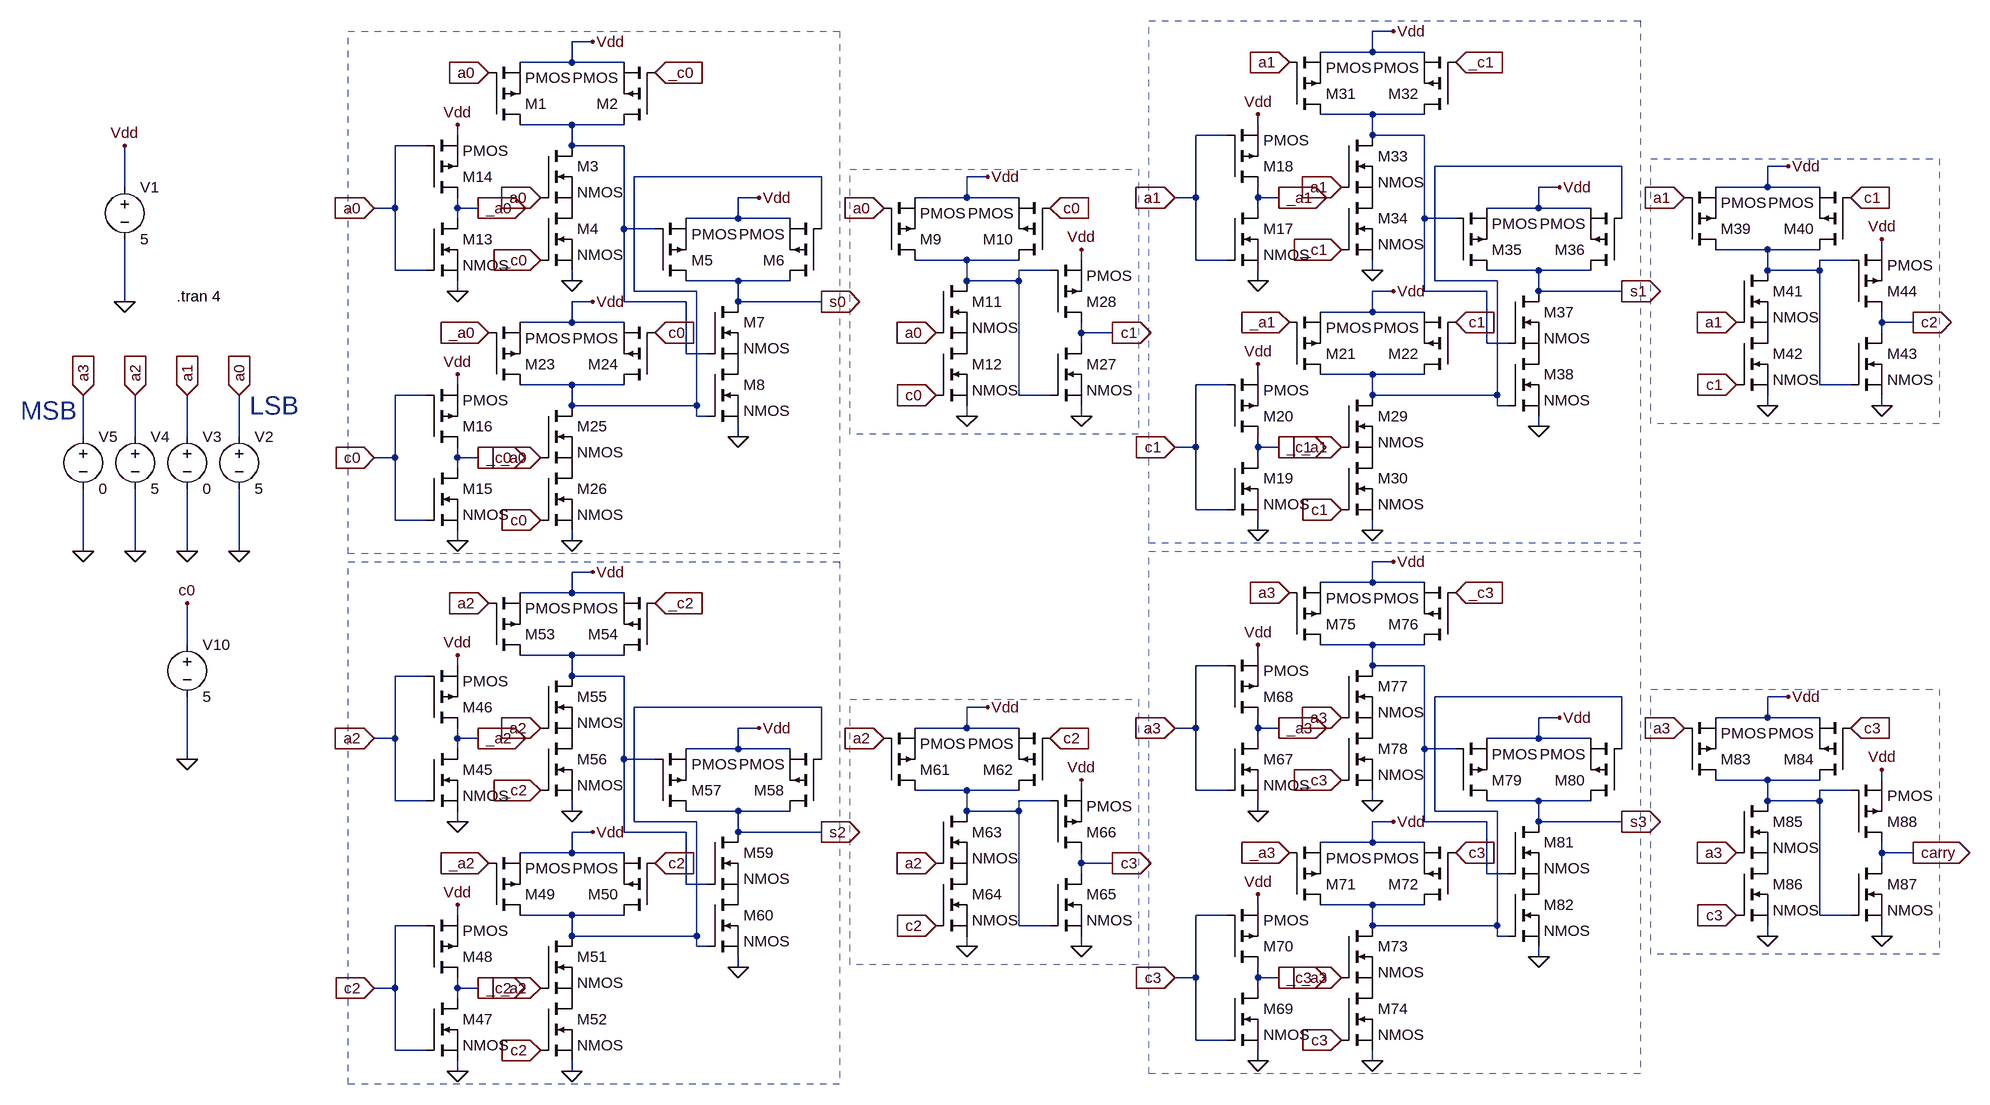
[diagram p0: schematic 4 bit 1 Increment.asc]
4 bit 1 Increment.asc, the LTspice schematic file:
Version 4
SHEET 1 2684 1276
WIRE 1568 -736 1536 -736
WIRE 336 -720 304 -720
WIRE 1536 -704 1536 -736
WIRE 1536 -704 1456 -704
WIRE 1616 -704 1536 -704
WIRE 304 -688 304 -720
WIRE 304 -688 224 -688
WIRE 384 -688 304 -688
WIRE 1536 -608 1456 -608
WIRE 1616 -608 1536 -608
WIRE 304 -592 224 -592
WIRE 384 -592 304 -592
WIRE 1360 -592 1360 -608
WIRE 128 -576 128 -592
WIRE 1312 -576 1264 -576
WIRE 1536 -576 1536 -608
WIRE 1616 -576 1536 -576
WIRE 80 -560 32 -560
WIRE 304 -560 304 -592
WIRE 384 -560 304 -560
WIRE 1920 -528 1632 -528
WIRE 2176 -528 2144 -528
WIRE 688 -512 400 -512
WIRE 944 -512 912 -512
WIRE -384 -496 -384 -560
WIRE 1824 -496 1792 -496
WIRE 2144 -496 2144 -528
WIRE 2144 -496 2064 -496
WIRE 2224 -496 2144 -496
WIRE 592 -480 560 -480
WIRE 912 -480 912 -512
WIRE 912 -480 832 -480
WIRE 992 -480 912 -480
WIRE 1264 -480 1264 -576
WIRE 1264 -480 1232 -480
WIRE 1360 -480 1360 -496
WIRE 1392 -480 1360 -480
WIRE 32 -464 32 -560
WIRE 32 -464 0 -464
WIRE 128 -464 128 -480
WIRE 160 -464 128 -464
WIRE 1360 -464 1360 -480
WIRE 1792 -464 1792 -496
WIRE 1792 -464 1712 -464
WIRE 1872 -464 1792 -464
WIRE 128 -448 128 -464
WIRE 560 -448 560 -480
WIRE 560 -448 480 -448
WIRE 640 -448 560 -448
WIRE 1616 -448 1616 -576
WIRE 1664 -448 1616 -448
WIRE 1920 -448 1920 -528
WIRE 384 -432 384 -560
WIRE 432 -432 384 -432
WIRE 688 -432 688 -512
WIRE 2144 -400 2064 -400
WIRE 2224 -400 2144 -400
WIRE 2320 -400 2320 -416
WIRE 912 -384 832 -384
WIRE 992 -384 912 -384
WIRE 1088 -384 1088 -400
WIRE 1264 -384 1264 -480
WIRE 1312 -384 1264 -384
WIRE 2272 -384 2224 -384
WIRE 32 -368 32 -464
WIRE 80 -368 32 -368
WIRE 1040 -368 992 -368
WIRE 1536 -368 1536 -384
WIRE 1792 -368 1712 -368
WIRE 1872 -368 1792 -368
WIRE 2144 -368 2144 -400
WIRE 2224 -368 2224 -384
WIRE 2224 -368 2144 -368
WIRE 304 -352 304 -368
WIRE 560 -352 480 -352
WIRE 640 -352 560 -352
WIRE 912 -352 912 -384
WIRE 992 -352 992 -368
WIRE 992 -352 912 -352
WIRE 1360 -352 1360 -368
WIRE 1632 -352 1632 -528
WIRE 1728 -352 1632 -352
WIRE 128 -336 128 -352
WIRE 400 -336 400 -512
WIRE 496 -336 400 -336
WIRE 1568 -336 1536 -336
WIRE 1616 -336 1616 -448
WIRE 1712 -336 1616 -336
WIRE 1792 -336 1792 -368
WIRE 1920 -336 1792 -336
WIRE -384 -320 -384 -416
WIRE 336 -320 304 -320
WIRE 384 -320 384 -432
WIRE 480 -320 384 -320
WIRE 560 -320 560 -352
WIRE 688 -320 560 -320
WIRE 1536 -304 1536 -336
WIRE 1536 -304 1456 -304
WIRE 1616 -304 1536 -304
WIRE 304 -288 304 -320
WIRE 304 -288 224 -288
WIRE 384 -288 304 -288
WIRE 2320 -288 2320 -304
WIRE 2368 -288 2320 -288
WIRE 1088 -272 1088 -288
WIRE 1136 -272 1088 -272
WIRE 2320 -272 2320 -288
WIRE 1088 -256 1088 -272
WIRE 1712 -256 1712 -336
WIRE 1744 -256 1712 -256
WIRE 480 -240 480 -320
WIRE 512 -240 480 -240
WIRE 1360 -208 1360 -224
WIRE 1536 -208 1456 -208
WIRE 1616 -208 1536 -208
WIRE 128 -192 128 -208
WIRE 304 -192 224 -192
WIRE 384 -192 304 -192
WIRE 1312 -192 1264 -192
WIRE 2224 -192 2224 -368
WIRE 2272 -192 2224 -192
WIRE 80 -176 32 -176
WIRE 992 -176 992 -352
WIRE 1040 -176 992 -176
WIRE 1536 -176 1536 -208
WIRE 1728 -176 1728 -352
WIRE 1728 -176 1536 -176
WIRE 304 -160 304 -192
WIRE 496 -160 496 -336
WIRE 496 -160 304 -160
WIRE 1728 -160 1728 -176
WIRE 1744 -160 1728 -160
WIRE 2144 -160 2144 -176
WIRE 2320 -160 2320 -176
WIRE 496 -144 496 -160
WIRE 512 -144 496 -144
WIRE 912 -144 912 -160
WIRE 1088 -144 1088 -160
WIRE 1792 -128 1792 -144
WIRE -448 -112 -448 -176
WIRE -368 -112 -368 -176
WIRE -288 -112 -288 -176
WIRE -208 -112 -208 -176
WIRE 560 -112 560 -128
WIRE 1264 -96 1264 -192
WIRE 1264 -96 1232 -96
WIRE 1360 -96 1360 -112
WIRE 1392 -96 1360 -96
WIRE 32 -80 32 -176
WIRE 32 -80 0 -80
WIRE 128 -80 128 -96
WIRE 160 -80 128 -80
WIRE 1360 -80 1360 -96
WIRE 128 -64 128 -80
WIRE 1264 0 1264 -96
WIRE 1312 0 1264 0
WIRE 32 16 32 -80
WIRE 80 16 32 16
WIRE 1360 32 1360 16
WIRE 1536 32 1536 16
WIRE 128 48 128 32
WIRE 304 48 304 32
WIRE -448 64 -448 -32
WIRE -368 64 -368 -32
WIRE -288 64 -288 -32
WIRE -208 64 -208 -32
WIRE 1568 80 1536 80
WIRE 336 96 304 96
WIRE 1536 112 1536 80
WIRE 1536 112 1456 112
WIRE 1616 112 1536 112
WIRE 304 128 304 96
WIRE 304 128 224 128
WIRE 384 128 304 128
WIRE -288 208 -288 144
WIRE 1536 208 1456 208
WIRE 1616 208 1536 208
WIRE 304 224 224 224
WIRE 384 224 304 224
WIRE 1360 224 1360 208
WIRE 128 240 128 224
WIRE 1312 240 1264 240
WIRE 1536 240 1536 208
WIRE 1616 240 1536 240
WIRE 80 256 32 256
WIRE 304 256 304 224
WIRE 384 256 304 256
WIRE 1920 288 1632 288
WIRE 2176 288 2144 288
WIRE 688 304 400 304
WIRE 944 304 912 304
WIRE 1824 320 1792 320
WIRE 2144 320 2144 288
WIRE 2144 320 2064 320
WIRE 2224 320 2144 320
WIRE 592 336 560 336
WIRE 912 336 912 304
WIRE 912 336 832 336
WIRE 992 336 912 336
WIRE 1264 336 1264 240
WIRE 1264 336 1232 336
WIRE 1360 336 1360 320
WIRE 1392 336 1360 336
WIRE 32 352 32 256
WIRE 32 352 0 352
WIRE 128 352 128 336
WIRE 160 352 128 352
WIRE 1360 352 1360 336
WIRE 1792 352 1792 320
WIRE 1792 352 1712 352
WIRE 1872 352 1792 352
WIRE 128 368 128 352
WIRE 560 368 560 336
WIRE 560 368 480 368
WIRE 640 368 560 368
WIRE 1616 368 1616 240
WIRE 1664 368 1616 368
WIRE 1920 368 1920 288
WIRE -288 384 -288 288
WIRE 384 384 384 256
WIRE 432 384 384 384
WIRE 688 384 688 304
WIRE 2144 416 2064 416
WIRE 2224 416 2144 416
WIRE 2320 416 2320 400
WIRE 912 432 832 432
WIRE 992 432 912 432
WIRE 1088 432 1088 416
WIRE 1264 432 1264 336
WIRE 1312 432 1264 432
WIRE 2272 432 2224 432
WIRE 32 448 32 352
WIRE 80 448 32 448
WIRE 1040 448 992 448
WIRE 1536 448 1536 432
WIRE 1792 448 1712 448
WIRE 1872 448 1792 448
WIRE 2144 448 2144 416
WIRE 2224 448 2224 432
WIRE 2224 448 2144 448
WIRE 304 464 304 448
WIRE 560 464 480 464
WIRE 640 464 560 464
WIRE 912 464 912 432
WIRE 992 464 992 448
WIRE 992 464 912 464
WIRE 1360 464 1360 448
WIRE 1632 464 1632 288
WIRE 1728 464 1632 464
WIRE 128 480 128 464
WIRE 400 480 400 304
WIRE 496 480 400 480
WIRE 1568 480 1536 480
WIRE 1616 480 1616 368
WIRE 1712 480 1616 480
WIRE 1792 480 1792 448
WIRE 1920 480 1792 480
WIRE 336 496 304 496
WIRE 384 496 384 384
WIRE 480 496 384 496
WIRE 560 496 560 464
WIRE 688 496 560 496
WIRE 1536 512 1536 480
WIRE 1536 512 1456 512
WIRE 1616 512 1536 512
WIRE 304 528 304 496
WIRE 304 528 224 528
WIRE 384 528 304 528
WIRE 2320 528 2320 512
WIRE 2368 528 2320 528
WIRE 1088 544 1088 528
WIRE 1136 544 1088 544
WIRE 2320 544 2320 528
WIRE 1088 560 1088 544
WIRE 1712 560 1712 480
WIRE 1744 560 1712 560
WIRE 480 576 480 496
WIRE 512 576 480 576
WIRE 1360 608 1360 592
WIRE 1536 608 1456 608
WIRE 1616 608 1536 608
WIRE 128 624 128 608
WIRE 304 624 224 624
WIRE 384 624 304 624
WIRE 1312 624 1264 624
WIRE 2224 624 2224 448
WIRE 2272 624 2224 624
WIRE 80 640 32 640
WIRE 992 640 992 464
WIRE 1040 640 992 640
WIRE 1536 640 1536 608
WIRE 1728 640 1728 464
WIRE 1728 640 1536 640
WIRE 304 656 304 624
WIRE 496 656 496 480
WIRE 496 656 304 656
WIRE 1728 656 1728 640
WIRE 1744 656 1728 656
WIRE 2144 656 2144 640
WIRE 2320 656 2320 640
WIRE 496 672 496 656
WIRE 512 672 496 672
WIRE 912 672 912 656
WIRE 1088 672 1088 656
WIRE 1792 688 1792 672
WIRE 560 704 560 688
WIRE 1264 720 1264 624
WIRE 1264 720 1232 720
WIRE 1360 720 1360 704
WIRE 1392 720 1360 720
WIRE 32 736 32 640
WIRE 32 736 0 736
WIRE 128 736 128 720
WIRE 160 736 128 736
WIRE 1360 736 1360 720
WIRE 128 752 128 736
WIRE 1264 816 1264 720
WIRE 1312 816 1264 816
WIRE 32 832 32 736
WIRE 80 832 32 832
WIRE 1360 848 1360 832
WIRE 1536 848 1536 832
WIRE 128 864 128 848
WIRE 304 864 304 848
FLAG 128 -336 0
FLAG 128 -592 Vdd
FLAG 160 -464 _a0
IOPIN 160 -464 Out
FLAG 0 -464 a0
IOPIN 0 -464 In
FLAG 128 48 0
FLAG 128 -208 Vdd
FLAG 160 -80 _c0
IOPIN 160 -80 Out
FLAG 0 -80 c0
IOPIN 0 -80 In
FLAG 336 -320 Vdd
FLAG 304 48 0
FLAG 256 -80 _a0
IOPIN 256 -80 In
FLAG 432 -272 c0
IOPIN 432 -272 In
FLAG 256 16 c0
IOPIN 256 16 In
FLAG 176 -272 _a0
IOPIN 176 -272 In
FLAG 336 -720 Vdd
FLAG 304 -352 0
FLAG 256 -480 a0
IOPIN 256 -480 In
FLAG 432 -672 _c0
IOPIN 432 -672 In
FLAG 256 -384 _c0
IOPIN 256 -384 In
FLAG 176 -672 a0
IOPIN 176 -672 In
FLAG 592 -480 Vdd
FLAG 560 -112 0
FLAG 688 -320 s0
IOPIN 688 -320 Out
FLAG 944 -512 Vdd
FLAG 912 -144 0
FLAG 864 -272 a0
IOPIN 864 -272 In
FLAG 1040 -464 c0
IOPIN 1040 -464 In
FLAG 784 -464 a0
IOPIN 784 -464 In
FLAG 864 -176 c0
IOPIN 864 -176 In
FLAG 1088 -144 0
FLAG 1088 -400 Vdd
FLAG 1136 -272 c1
IOPIN 1136 -272 Out
FLAG -384 -320 0
FLAG -384 -560 Vdd
FLAG -208 64 0
FLAG -208 -176 a0
IOPIN -208 -176 In
FLAG -288 64 0
FLAG -288 -176 a1
IOPIN -288 -176 In
FLAG -368 64 0
FLAG -368 -176 a2
IOPIN -368 -176 In
FLAG -448 64 0
FLAG -448 -176 a3
IOPIN -448 -176 In
FLAG 1360 -352 0
FLAG 1360 -608 Vdd
FLAG 1392 -480 _a1
IOPIN 1392 -480 Out
FLAG 1232 -480 a1
IOPIN 1232 -480 In
FLAG 1360 32 0
FLAG 1360 -224 Vdd
FLAG 1392 -96 _c1
IOPIN 1392 -96 Out
FLAG 1232 -96 c1
IOPIN 1232 -96 In
FLAG 1568 -336 Vdd
FLAG 1536 32 0
FLAG 1488 -96 _a1
IOPIN 1488 -96 In
FLAG 1664 -288 c1
IOPIN 1664 -288 In
FLAG 1488 0 c1
IOPIN 1488 0 In
FLAG 1408 -288 _a1
IOPIN 1408 -288 In
FLAG 1568 -736 Vdd
FLAG 1536 -368 0
FLAG 1488 -496 a1
IOPIN 1488 -496 In
FLAG 1664 -688 _c1
IOPIN 1664 -688 In
FLAG 1488 -400 _c1
IOPIN 1488 -400 In
FLAG 1408 -688 a1
IOPIN 1408 -688 In
FLAG 1824 -496 Vdd
FLAG 1792 -128 0
FLAG 1920 -336 s1
IOPIN 1920 -336 Out
FLAG 2176 -528 Vdd
FLAG 2144 -160 0
FLAG 2096 -288 a1
IOPIN 2096 -288 In
FLAG 2272 -480 c1
IOPIN 2272 -480 In
FLAG 2016 -480 a1
IOPIN 2016 -480 In
FLAG 2096 -192 c1
IOPIN 2096 -192 In
FLAG 2320 -160 0
FLAG 2320 -416 Vdd
FLAG 2368 -288 c2
IOPIN 2368 -288 Out
FLAG 128 480 0
FLAG 128 224 Vdd
FLAG 160 352 _a2
IOPIN 160 352 Out
FLAG 0 352 a2
IOPIN 0 352 In
FLAG 128 864 0
FLAG 128 608 Vdd
FLAG 160 736 _c2
IOPIN 160 736 Out
FLAG 0 736 c2
IOPIN 0 736 In
FLAG 336 496 Vdd
FLAG 304 864 0
FLAG 256 736 _a2
IOPIN 256 736 In
FLAG 432 544 c2
IOPIN 432 544 In
FLAG 256 832 c2
IOPIN 256 832 In
FLAG 176 544 _a2
IOPIN 176 544 In
FLAG 336 96 Vdd
FLAG 304 464 0
FLAG 256 336 a2
IOPIN 256 336 In
FLAG 432 144 _c2
IOPIN 432 144 In
FLAG 256 432 _c2
IOPIN 256 432 In
FLAG 176 144 a2
IOPIN 176 144 In
FLAG 592 336 Vdd
FLAG 560 704 0
FLAG 688 496 s2
IOPIN 688 496 Out
FLAG 944 304 Vdd
FLAG 912 672 0
FLAG 864 544 a2
IOPIN 864 544 In
FLAG 1040 352 c2
IOPIN 1040 352 In
FLAG 784 352 a2
IOPIN 784 352 In
FLAG 864 640 c2
IOPIN 864 640 In
FLAG 1088 672 0
FLAG 1088 416 Vdd
FLAG 1136 544 c3
IOPIN 1136 544 Out
FLAG 1360 464 0
FLAG 1360 208 Vdd
FLAG 1392 336 _a3
IOPIN 1392 336 Out
FLAG 1232 336 a3
IOPIN 1232 336 In
FLAG 1360 848 0
FLAG 1360 592 Vdd
FLAG 1392 720 _c3
IOPIN 1392 720 Out
FLAG 1232 720 c3
IOPIN 1232 720 In
FLAG 1568 480 Vdd
FLAG 1536 848 0
FLAG 1488 720 _a3
IOPIN 1488 720 In
FLAG 1664 528 c3
IOPIN 1664 528 In
FLAG 1488 816 c3
IOPIN 1488 816 In
FLAG 1408 528 _a3
IOPIN 1408 528 In
FLAG 1568 80 Vdd
FLAG 1536 448 0
FLAG 1488 320 a3
IOPIN 1488 320 In
FLAG 1664 128 _c3
IOPIN 1664 128 In
FLAG 1488 416 _c3
IOPIN 1488 416 In
FLAG 1408 128 a3
IOPIN 1408 128 In
FLAG 1824 320 Vdd
FLAG 1792 688 0
FLAG 1920 480 s3
IOPIN 1920 480 Out
FLAG 2176 288 Vdd
FLAG 2144 656 0
FLAG 2096 528 a3
IOPIN 2096 528 In
FLAG 2272 336 c3
IOPIN 2272 336 In
FLAG 2016 336 a3
IOPIN 2016 336 In
FLAG 2096 624 c3
IOPIN 2096 624 In
FLAG 2320 656 0
FLAG 2320 400 Vdd
FLAG 2368 528 carry
IOPIN 2368 528 Out
FLAG -288 384 0
FLAG -288 144 c0
SYMBOL nmos 80 -448 R0
SYMATTR InstName M13
SYMBOL pmos 80 -480 M180
SYMATTR InstName M14
SYMBOL nmos 80 -64 R0
SYMATTR InstName M15
SYMBOL pmos 80 -96 M180
SYMATTR InstName M16
SYMBOL pmos 176 -192 M180
SYMATTR InstName M23
SYMBOL pmos 432 -192 R180
SYMATTR InstName M24
SYMBOL nmos 256 -160 R0
SYMATTR InstName M25
SYMBOL nmos 256 -64 R0
SYMATTR InstName M26
SYMBOL pmos 176 -592 M180
SYMATTR InstName M1
SYMBOL pmos 432 -592 R180
SYMATTR InstName M2
SYMBOL nmos 256 -560 R0
SYMATTR InstName M3
SYMBOL nmos 256 -464 R0
SYMATTR InstName M4
SYMBOL pmos 432 -352 M180
SYMATTR InstName M5
SYMBOL pmos 688 -352 R180
SYMATTR InstName M6
SYMBOL nmos 512 -320 R0
SYMATTR InstName M7
SYMBOL nmos 512 -224 R0
SYMATTR InstName M8
SYMBOL pmos 784 -384 M180
SYMATTR InstName M9
SYMBOL pmos 1040 -384 R180
SYMATTR InstName M10
SYMBOL nmos 864 -352 R0
SYMATTR InstName M11
SYMBOL nmos 864 -256 R0
SYMATTR InstName M12
SYMBOL nmos 1040 -256 R0
SYMATTR InstName M27
SYMBOL pmos 1040 -288 M180
SYMATTR InstName M28
SYMBOL voltage -384 -512 R0
SYMATTR InstName V1
SYMATTR Value 5
SYMBOL voltage -208 -128 R0
SYMATTR InstName V2
SYMATTR Value 5
SYMBOL voltage -288 -128 R0
SYMATTR InstName V3
SYMATTR Value 0
SYMBOL voltage -368 -128 R0
SYMATTR InstName V4
SYMATTR Value 5
SYMBOL voltage -448 -128 R0
SYMATTR InstName V5
SYMATTR Value 0
SYMBOL nmos 1312 -464 R0
SYMATTR InstName M17
SYMBOL pmos 1312 -496 M180
SYMATTR InstName M18
SYMBOL nmos 1312 -80 R0
SYMATTR InstName M19
SYMBOL pmos 1312 -112 M180
SYMATTR InstName M20
SYMBOL pmos 1408 -208 M180
SYMATTR InstName M21
SYMBOL pmos 1664 -208 R180
SYMATTR InstName M22
SYMBOL nmos 1488 -176 R0
SYMATTR InstName M29
SYMBOL nmos 1488 -80 R0
SYMATTR InstName M30
SYMBOL pmos 1408 -608 M180
SYMATTR InstName M31
SYMBOL pmos 1664 -608 R180
SYMATTR InstName M32
SYMBOL nmos 1488 -576 R0
SYMATTR InstName M33
SYMBOL nmos 1488 -480 R0
SYMATTR InstName M34
SYMBOL pmos 1664 -368 M180
SYMATTR InstName M35
SYMBOL pmos 1920 -368 R180
SYMATTR InstName M36
SYMBOL nmos 1744 -336 R0
SYMATTR InstName M37
SYMBOL nmos 1744 -240 R0
SYMATTR InstName M38
SYMBOL pmos 2016 -400 M180
SYMATTR InstName M39
SYMBOL pmos 2272 -400 R180
SYMATTR InstName M40
SYMBOL nmos 2096 -368 R0
SYMATTR InstName M41
SYMBOL nmos 2096 -272 R0
SYMATTR InstName M42
SYMBOL nmos 2272 -272 R0
SYMATTR InstName M43
SYMBOL pmos 2272 -304 M180
SYMATTR InstName M44
SYMBOL nmos 80 368 R0
SYMATTR InstName M45
SYMBOL pmos 80 336 M180
SYMATTR InstName M46
SYMBOL nmos 80 752 R0
SYMATTR InstName M47
SYMBOL pmos 80 720 M180
SYMATTR InstName M48
SYMBOL pmos 176 624 M180
SYMATTR InstName M49
SYMBOL pmos 432 624 R180
SYMATTR InstName M50
SYMBOL nmos 256 656 R0
SYMATTR InstName M51
SYMBOL nmos 256 752 R0
SYMATTR InstName M52
SYMBOL pmos 176 224 M180
SYMATTR InstName M53
SYMBOL pmos 432 224 R180
SYMATTR InstName M54
SYMBOL nmos 256 256 R0
SYMATTR InstName M55
SYMBOL nmos 256 352 R0
SYMATTR InstName M56
SYMBOL pmos 432 464 M180
SYMATTR InstName M57
SYMBOL pmos 688 464 R180
SYMATTR InstName M58
SYMBOL nmos 512 496 R0
SYMATTR InstName M59
SYMBOL nmos 512 592 R0
SYMATTR InstName M60
SYMBOL pmos 784 432 M180
SYMATTR InstName M61
SYMBOL pmos 1040 432 R180
SYMATTR InstName M62
SYMBOL nmos 864 464 R0
SYMATTR InstName M63
SYMBOL nmos 864 560 R0
SYMATTR InstName M64
SYMBOL nmos 1040 560 R0
SYMATTR InstName M65
SYMBOL pmos 1040 528 M180
SYMATTR InstName M66
SYMBOL nmos 1312 352 R0
SYMATTR InstName M67
SYMBOL pmos 1312 320 M180
SYMATTR InstName M68
SYMBOL nmos 1312 736 R0
SYMATTR InstName M69
SYMBOL pmos 1312 704 M180
SYMATTR InstName M70
SYMBOL pmos 1408 608 M180
SYMATTR InstName M71
SYMBOL pmos 1664 608 R180
SYMATTR InstName M72
SYMBOL nmos 1488 640 R0
SYMATTR InstName M73
SYMBOL nmos 1488 736 R0
SYMATTR InstName M74
SYMBOL pmos 1408 208 M180
SYMATTR InstName M75
SYMBOL pmos 1664 208 R180
SYMATTR InstName M76
SYMBOL nmos 1488 240 R0
SYMATTR InstName M77
SYMBOL nmos 1488 336 R0
SYMATTR InstName M78
SYMBOL pmos 1664 448 M180
SYMATTR InstName M79
SYMBOL pmos 1920 448 R180
SYMATTR InstName M80
SYMBOL nmos 1744 480 R0
SYMATTR InstName M81
SYMBOL nmos 1744 576 R0
SYMATTR InstName M82
SYMBOL pmos 2016 416 M180
SYMATTR InstName M83
SYMBOL pmos 2272 416 R180
SYMATTR InstName M84
SYMBOL nmos 2096 448 R0
SYMATTR InstName M85
SYMBOL nmos 2096 544 R0
SYMATTR InstName M86
SYMBOL nmos 2272 544 R0
SYMATTR InstName M87
SYMBOL pmos 2272 512 M180
SYMATTR InstName M88
SYMBOL voltage -288 192 R0
SYMATTR InstName V10
SYMATTR Value 5
TEXT -304 -328 Left 2 !.tran 4
TEXT -192 -160 Left 4 ;LSB
TEXT -544 -152 Left 4 ;MSB
RECTANGLE Normal 716 68 -40 -736 2
RECTANGLE Normal 1176 -116 732 -524 2
RECTANGLE Normal 1948 52 1192 -752 2
RECTANGLE Normal 2408 -132 1964 -540 2
RECTANGLE Normal 716 884 -40 80 2
RECTANGLE Normal 1176 700 732 292 2
RECTANGLE Normal 1948 868 1192 64 2
RECTANGLE Normal 2408 684 1964 276 2

The netlist it stands for:
* 4 bit 1 Increment.asc
M13 _a0 a0 0 0 NMOS
M14 _a0 a0 Vdd Vdd PMOS
M15 _c0 c0 0 0 NMOS
M16 _c0 c0 Vdd Vdd PMOS
M23 N004 _a0 Vdd Vdd PMOS
M24 N004 c0 Vdd Vdd PMOS
M25 N004 _a0 P001 P001 NMOS
M26 P001 c0 0 0 NMOS
M1 N002 a0 Vdd Vdd PMOS
M2 N002 _c0 Vdd Vdd PMOS
M3 N002 a0 P002 P002 NMOS
M4 P002 _c0 0 0 NMOS
M5 s0 N002 Vdd Vdd PMOS
M6 s0 N004 Vdd Vdd PMOS
M7 s0 N002 P003 P003 NMOS
M8 P003 N004 0 0 NMOS
M9 N006 a0 Vdd Vdd PMOS
M10 N006 c0 Vdd Vdd PMOS
M11 N006 a0 P004 P004 NMOS
M12 P004 c0 0 0 NMOS
M27 c1 N006 0 0 NMOS
M28 c1 N006 Vdd Vdd PMOS
V1 Vdd 0 5
V2 a0 0 5
V3 a1 0 0
V4 a2 0 5
V5 a3 0 0
M17 _a1 a1 0 0 NMOS
M18 _a1 a1 Vdd Vdd PMOS
M19 _c1 c1 0 0 NMOS
M20 _c1 c1 Vdd Vdd PMOS
M21 N003 _a1 Vdd Vdd PMOS
M22 N003 c1 Vdd Vdd PMOS
M29 N003 _a1 P005 P005 NMOS
M30 P005 c1 0 0 NMOS
M31 N001 a1 Vdd Vdd PMOS
M32 N001 _c1 Vdd Vdd PMOS
M33 N001 a1 P006 P006 NMOS
M34 P006 _c1 0 0 NMOS
M35 s1 N001 Vdd Vdd PMOS
M36 s1 N003 Vdd Vdd PMOS
M37 s1 N001 P007 P007 NMOS
M38 P007 N003 0 0 NMOS
M39 N005 a1 Vdd Vdd PMOS
M40 N005 c1 Vdd Vdd PMOS
M41 N005 a1 P008 P008 NMOS
M42 P008 c1 0 0 NMOS
M43 c2 N005 0 0 NMOS
M44 c2 N005 Vdd Vdd PMOS
M45 _a2 a2 0 0 NMOS
M46 _a2 a2 Vdd Vdd PMOS
M47 _c2 c2 0 0 NMOS
M48 _c2 c2 Vdd Vdd PMOS
M49 N010 _a2 Vdd Vdd PMOS
M50 N010 c2 Vdd Vdd PMOS
M51 N010 _a2 P009 P009 NMOS
M52 P009 c2 0 0 NMOS
M53 N008 a2 Vdd Vdd PMOS
M54 N008 _c2 Vdd Vdd PMOS
M55 N008 a2 P010 P010 NMOS
M56 P010 _c2 0 0 NMOS
M57 s2 N008 Vdd Vdd PMOS
M58 s2 N010 Vdd Vdd PMOS
M59 s2 N008 P011 P011 NMOS
M60 P011 N010 0 0 NMOS
M61 N012 a2 Vdd Vdd PMOS
M62 N012 c2 Vdd Vdd PMOS
M63 N012 a2 P012 P012 NMOS
M64 P012 c2 0 0 NMOS
M65 c3 N012 0 0 NMOS
M66 c3 N012 Vdd Vdd PMOS
M67 _a3 a3 0 0 NMOS
M68 _a3 a3 Vdd Vdd PMOS
M69 _c3 c3 0 0 NMOS
M70 _c3 c3 Vdd Vdd PMOS
M71 N009 _a3 Vdd Vdd PMOS
M72 N009 c3 Vdd Vdd PMOS
M73 N009 _a3 P013 P013 NMOS
M74 P013 c3 0 0 NMOS
M75 N007 a3 Vdd Vdd PMOS
M76 N007 _c3 Vdd Vdd PMOS
M77 N007 a3 P014 P014 NMOS
M78 P014 _c3 0 0 NMOS
M79 s3 N007 Vdd Vdd PMOS
M80 s3 N009 Vdd Vdd PMOS
M81 s3 N007 P015 P015 NMOS
M82 P015 N009 0 0 NMOS
M83 N011 a3 Vdd Vdd PMOS
M84 N011 c3 Vdd Vdd PMOS
M85 N011 a3 P016 P016 NMOS
M86 P016 c3 0 0 NMOS
M87 carry N011 0 0 NMOS
M88 carry N011 Vdd Vdd PMOS
V10 c0 0 5
.model NMOS NMOS
.model PMOS PMOS
.lib standard.mos
.tran 4
* LSB
* MSB
.backanno
.end